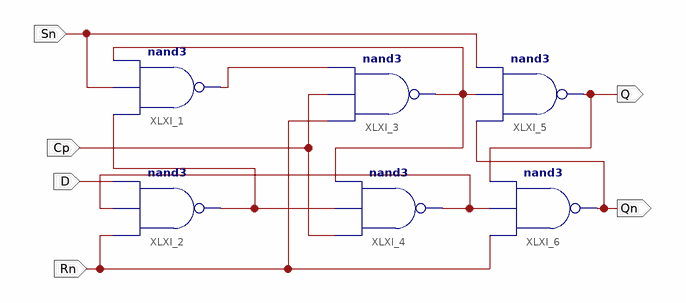
[diagram p0: schematic sheet 1]
// Xilinx ISE schematic MB_DFF.sch (kintex7) as structural Verilog: 6 symbols, 6 ports
module MB_DFF (
  input  Rn,
  input  D,
  input  Sn,
  input  Cp,
  output Q,
  output Qn
);

  wire XLXN_11, XLXN_17, XLXN_18, XLXN_98;

  nand XLXI_1 (XLXN_18, XLXN_98, Sn, XLXN_17);
  nand XLXI_2 (XLXN_98, Rn, XLXN_11, D);
  nand XLXI_3 (XLXN_17, Rn, Cp, XLXN_18);
  nand XLXI_4 (XLXN_11, Cp, XLXN_98, XLXN_17);
  nand XLXI_5 (Q, Qn, XLXN_17, Sn);
  nand XLXI_6 (Qn, Rn, XLXN_11, Q);
endmodule
